# Altium schematic sheet BUCK BOOST pre PMIC.SchDoc
size A4; SheetNumber: 19; SheetTotal: 20
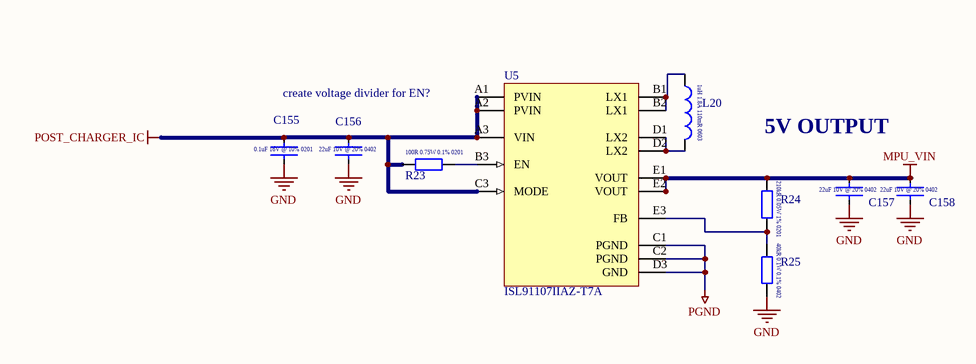
[diagram p0: BUCK BOOST pre PMIC.SchDoc]

## Parts
C155  0.1uF  [CAPC0603X03L]  (value not drawn)
C156  GRM158R61A226ME15D  [CAPC1005X06L]  (value not drawn)
C157  GRM158R61A226ME15D  [CAPC1005X06L]  (value not drawn)
C158  GRM158R61A226ME15D  [CAPC1005X06L]  (value not drawn)
L20  IHHP0603ZHER1R0M01  [INDC1608LPX08L]  (value not drawn)
R23  TNPW0201100RBEED  [RESC0603X03L]  (value not drawn)
R24  ERJ-1GNF2103C  [RESC0603X03L]  (value not drawn)
R25  RNCF0402BTE40K0  [RESC1005X04L]  (value not drawn)
U5  ISL91107IIAZ-T7A  [W3x5_15_MFG]

## Nets
GND: C155.1 C156.1 C157.1 C158.1 R25.2
MPU_VIN: C157.2 C158.2 R24.1 U5.E1(VOUT) U5.E2(VOUT)
PGND: U5.C1(PGND) U5.C2(PGND) U5.D3(GND)
POST_CHARGER_IC: C155.2 C156.2 R23.1 U5.A1(PVIN) U5.A2(PVIN) U5.A3(VIN) U5.C3(MODE)
NetL20_1: L20.1 U5.B1(LX1) U5.B2(LX1)
NetL20_2: L20.2 U5.D1(LX2) U5.D2(LX2)
NetR23_2: R23.2 U5.B3(EN)
NetR24_2: R24.2 R25.1 U5.E3(FB)

## Notes on the sheet
- create voltage divider for EN?
- 5V OUTPUT
- (in symbol ERJ-1GNF2103C) 210kR 0.05W 1% 0201
- (in symbol GRM033R61E104KE14J) 0.1uF 16V @ 10% 0201
- (in symbol GRM158R61A226ME15D) 22uF 10V @ 20% 0402
- (in symbol IHHP0603ZHER1R0M01) 1uH 1.8A 110mR 0603
- (in symbol RNCF0402BTE40K0) 40kR 0.1W 0.1% 0402
- (in symbol TNPW0201100RBEED) 100R 0.75W 0.1% 0201

## Library data of the parts
C155 = GRM033R61E104KE14J: 0.1 µF ±10% 25V Ceramic Capacitor X5R 0201 (0603 Metric)0.1 µF ±10% 25V Ceramic Capacitor X5R 0201 (0603 Metric); ComponentLink1Description: New link; ComponentLink1URL: https://www.digikey.com.au/en/products/detail/murata-electronics/GRM033R61E104KE14J/4904732?s=N4IgTCBcDaIOICUCyAGAzGhA2AjAURxQBYBpAogKRAF0BfIA
C156-C158 = GRM158R61A226ME15D: 22uH 0402; ComponentLink1Description: New link; ComponentLink1URL: https://www.digikey.com.au/en/products/detail/murata-electronics/GRM158R61A226ME15D/16033379
L20 = IHHP0603ZHER1R0M01: 1 µH Shielded Inductor 1.8 A 110mOhm Max 0603 (1608 Metric); ComponentLink1Description: New link; ComponentLink1URL: https://www.digikey.com.au/en/products/detail/vishay-dale/IHHP0603ZHER1R0M01/16583528
R23 = TNPW0201100RBEED: 100 Ohms ±0.1% 0.075W Chip Resistor 0201 (0603 Metric) Anti-Sulfur, Automotive AEC-Q200, Moisture Resistant Thin Film; Supplier 1: Mouser; Supplier Part Number 1: 71-TNPW0201100RBEED
R24 = ERJ-1GNF2103C: 210 kOhms ±1% 0.05W, 1/20W Chip Resistor 0201 (0603 Metric) Thick Film; ComponentLink1Description: New link; ComponentLink1URL: https://www.digikey.com.au/en/products/detail/panasonic-electronic-components/ERJ-1GNF2103C/2036374
R25 = RNCF0402BTE40K0: 40 kOhms ±0.1% 0.1W, 1/10W Chip Resistor 0402 (1005 Metric) Automotive AEC-Q200 Thin Film; ComponentLink1Description: New link; ComponentLink1URL: https://www.digikey.com.au/en/products/detail/stackpole-electronics-inc/RNCF0402BTE40K0/6259278
U5 = CMP-00572-88256049-2: ISL9110 Series 5.5 V 2.5 MHz High Efficiency Buck-Boost Regulator - WLCSP-15; Manufacturer Lifecycle Status: ACTIVE; Quiescent Current: 45µA; Min Supply Voltage: 1.8V; Max Output Current: 2A; Min Output Voltage: 1V; Switching Frequency: 2.5MHz; Max Supply Voltage: 5.5V; Pitch: 400µm; Max Junction Temperature (Tj): 125°C; Efficiency: 96%; Output Voltage: 5.2V; Lead Free: Lead Free; RoHS: Compliant; Number of Pins: 15; ComponentLink1URL: http://www.renesas.com; HelpURL: https://octopart.com/cad-content/api/get-model-datasheet/15189/88256049; ComponentLink1Description: Manufacturer's Website; Lifecycle Status: Production; ComponentLink2URL: https://octopart.com/cad-content/api/get-model-datasheet/15189/88256049; Mount: Surface Mount; ComponentLink3Description: Manufacturer's Package Drawing; Length: 2.1mm; Min Operating Temperature: -40°C; ComponentLink2Description: Datasheet URL; Max Operating Temperature: 85°C; ComponentLink3URL: https://www.renesas.com/en/document/psc/package-drawing-wlcsp-tkcurdl-15pin-w3x515; Height: 500µm; Max Output Voltage: 5.2V; Topology: Buck-Boost; Width: 1.5mm